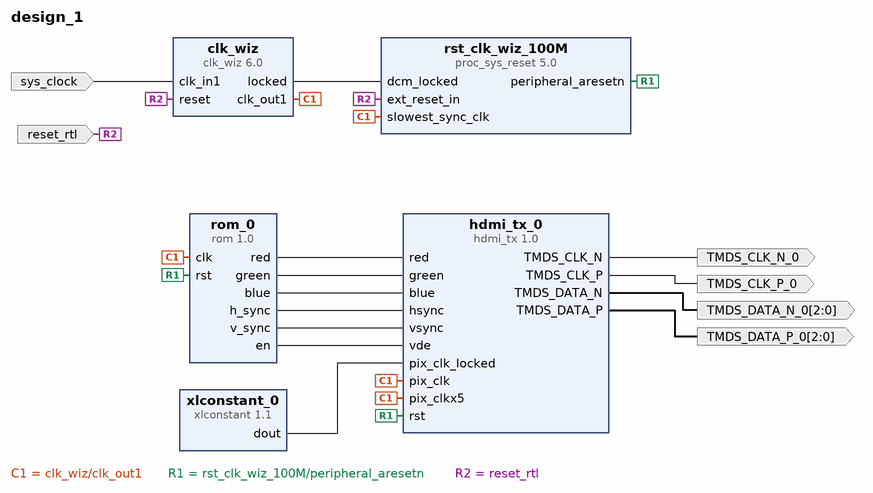
[diagram p0: block diagram of the top level]
# Vivado block design design_1, xc7z020clg400-1, Vivado 2020.2
create_bd_design design_1

create_bd_port -dir I -type clk sys_clock
set_property -dict {CONFIG.FREQ_HZ 125000000 CONFIG.PHASE 0.000} [get_bd_ports sys_clock]
create_bd_port -dir I -type rst reset_rtl
set_property -dict {CONFIG.POLARITY ACTIVE_HIGH} [get_bd_ports reset_rtl]
create_bd_port -dir O -from 2 -to 0 TMDS_DATA_P_0
create_bd_port -dir O -type clk TMDS_CLK_P_0
create_bd_port -dir O -from 2 -to 0 TMDS_DATA_N_0
create_bd_port -dir O -type clk TMDS_CLK_N_0

create_bd_cell -type ip -vlnv xilinx.com:ip:clk_wiz:6.0 clk_wiz
set_property -dict {CONFIG.CLK_IN1_BOARD_INTERFACE sys_clock CONFIG.USE_BOARD_FLOW true} [get_bd_cells clk_wiz]
create_bd_cell -type ip -vlnv xilinx.com:ip:proc_sys_reset:5.0 rst_clk_wiz_100M
create_bd_cell -type ip -vlnv realdigital.org:realdigital:hdmi_tx:1.0 hdmi_tx_0
create_bd_cell -type ip -vlnv xilinx.com:ip:xlconstant:1.1 xlconstant_0
create_bd_cell -type ip -vlnv xilinx.com:user:rom:1.0 rom_0

# ---- connections ----

connect_bd_net [get_bd_pins clk_wiz/clk_out1] \
  [get_bd_pins rst_clk_wiz_100M/slowest_sync_clk] [get_bd_pins hdmi_tx_0/pix_clk] [get_bd_pins hdmi_tx_0/pix_clkx5] \
  [get_bd_pins rom_0/clk]
connect_bd_net [get_bd_pins clk_wiz/locked] [get_bd_pins rst_clk_wiz_100M/dcm_locked]
connect_bd_net [get_bd_pins rst_clk_wiz_100M/peripheral_aresetn] [get_bd_pins hdmi_tx_0/rst] [get_bd_pins rom_0/rst]
connect_bd_net [get_bd_ports sys_clock] [get_bd_pins clk_wiz/clk_in1]
connect_bd_net [get_bd_ports reset_rtl] [get_bd_pins clk_wiz/reset] [get_bd_pins rst_clk_wiz_100M/ext_reset_in]
connect_bd_net [get_bd_pins rom_0/red] [get_bd_pins hdmi_tx_0/red]
connect_bd_net [get_bd_pins rom_0/green] [get_bd_pins hdmi_tx_0/green]
connect_bd_net [get_bd_pins rom_0/blue] [get_bd_pins hdmi_tx_0/blue]
connect_bd_net [get_bd_pins rom_0/h_sync] [get_bd_pins hdmi_tx_0/hsync]
connect_bd_net [get_bd_pins rom_0/v_sync] [get_bd_pins hdmi_tx_0/vsync]
connect_bd_net [get_bd_pins hdmi_tx_0/TMDS_DATA_P] [get_bd_ports TMDS_DATA_P_0]
connect_bd_net [get_bd_pins hdmi_tx_0/TMDS_CLK_P] [get_bd_ports TMDS_CLK_P_0]
connect_bd_net [get_bd_pins hdmi_tx_0/TMDS_DATA_N] [get_bd_ports TMDS_DATA_N_0]
connect_bd_net [get_bd_pins hdmi_tx_0/TMDS_CLK_N] [get_bd_ports TMDS_CLK_N_0]
connect_bd_net [get_bd_pins xlconstant_0/dout] [get_bd_pins hdmi_tx_0/pix_clk_locked]
connect_bd_net [get_bd_pins rom_0/en] [get_bd_pins hdmi_tx_0/vde]

validate_bd_design
save_bd_design
